# Altium project photodiodeAmplifier.PrjPcb
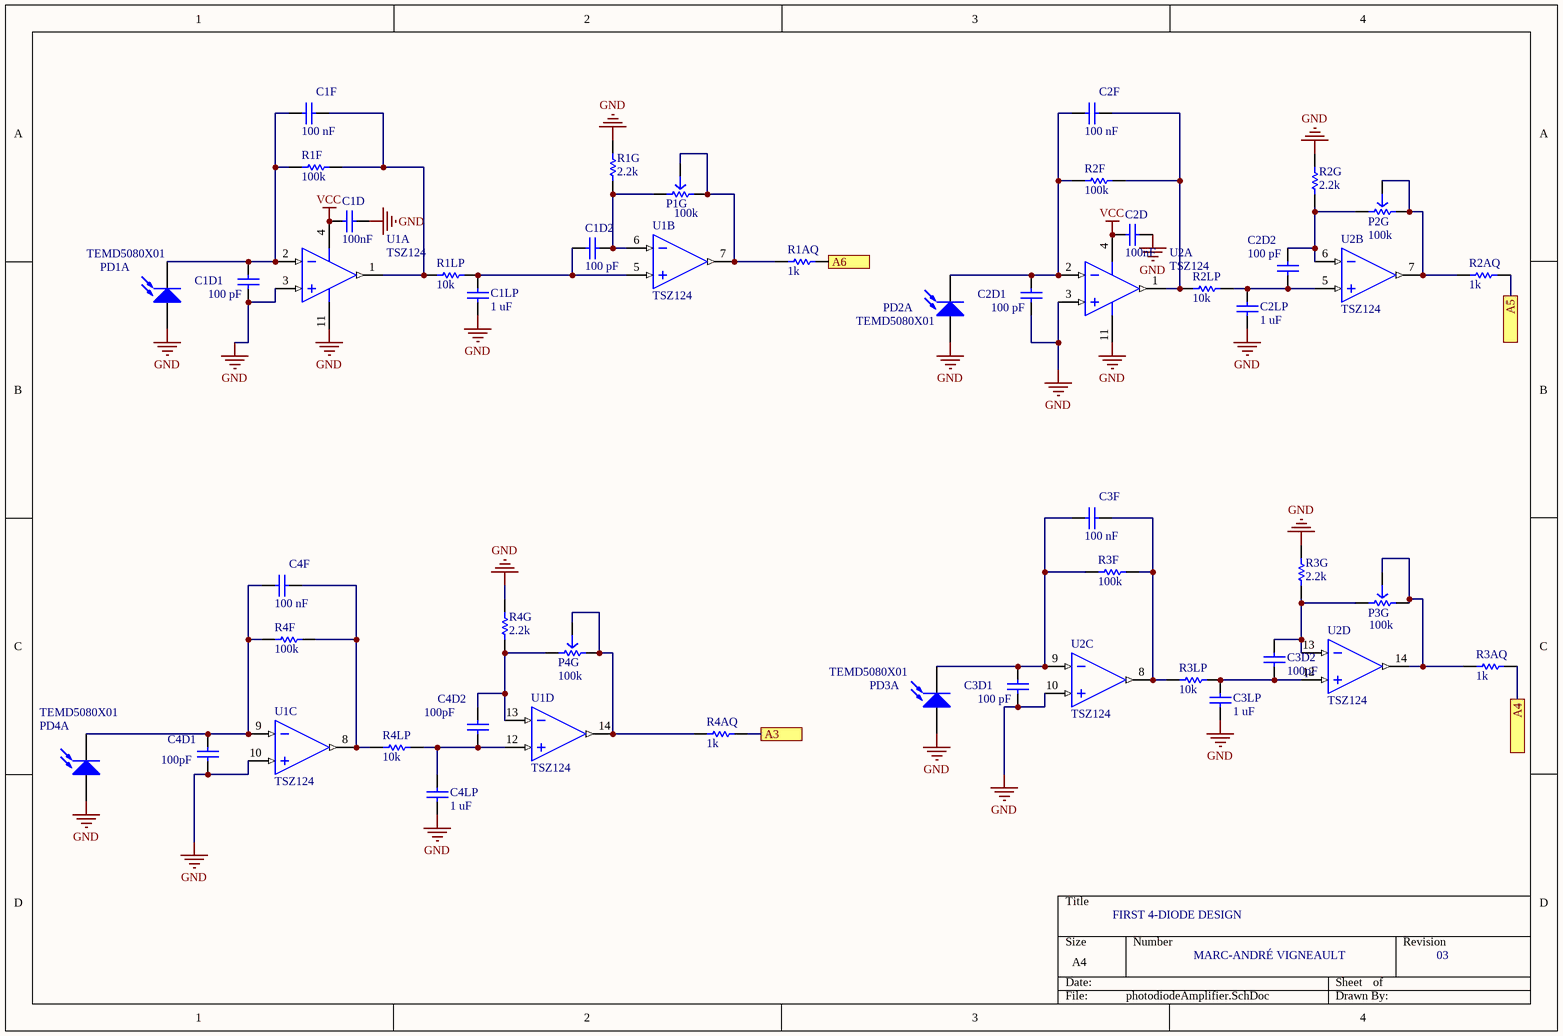
[diagram p0: photodiodeAmplifier.SchDoc]
2 sheets, 49 parts. Net scope: flat (ports and power ports of the same name join across sheets).
Board file: PD_PCB_with_routing.PcbDoc
Sheets:
  photodiodeAmplifier.SchDoc
  Sheet1.SchDoc

## Sheet photodiodeAmplifier.SchDoc
size A4

### Parts
C1D  100nF  [CAP 0805]
C1D1  100 pF  [CAP 0805]
C1D2  100 pF  [CAP 0805]
C1F  100 nF  [CAP 0805]
C1LP  1 uF  [CAP 0805]
C2D  100nF  [CAP 0805]
C2D1  100 pF  [CAP 0805]
C2D2  100 pF  [CAP 0805]
C2F  100 nF  [CAP 0805]
C2LP  1 uF  [CAP 0805]
C3D1  100 pF  [CAP 0805]
C3D2  100pF  [CAP 0805]
C3F  100 nF  [CAP 0805]
C3LP  1 uF  [CAP 0805]
C4D1  100pF  [CAP 0805]
C4D2  100pF  [CAP 0805]
C4F  100 nF  [CAP 0805]
C4LP  1 uF  [CAP 0805]
P1G  value 100k  [potentiometer trimmer straight]  (hidden comment: *)
P2G  value 100k  [potentiometer trimmer straight]  (hidden comment: Potentiometer Trimmer 90deg)
P3G  value 100k  [potentiometer trimmer straight]  (hidden comment: Potentiometer Trimmer 90deg)
P4G  value 100k  [potentiometer trimmer straight]
PD1  TEMD5080X01  [Photodiode SMD PKG-1]  (part A of 2)
PD2  TEMD5080X01  [Photodiode SMD PKG-1]  (part A of 2)
PD3  TEMD5080X01  [Photodiode SMD PKG-1]  (part A of 2)
PD4  TEMD5080X01  [Photodiode SMD PKG-1]  (part A of 2)
R1AQ  value 1k  [RES 0805]  (hidden comment: RES 0805)
R1F  value 100k  [RES 0805]  (hidden comment: RES 0805)
R1G  value 2.2k  [RES 0805]  (hidden comment: RES 0805)
R1LP  value 10k  [RES 0805]  (hidden comment: RES 0805)
R2AQ  value 1k  [RES 0805]  (hidden comment: RES 0805)
R2F  value 100k  [RES 0805]  (hidden comment: RES 0805)
R2G  value 2.2k  [RES 0805]  (hidden comment: RES 0805)
R2LP  value 10k  [RES 0805]  (hidden comment: RES 0805)
R3AQ  value 1k  [RES 0805]  (hidden comment: RES 0805)
R3F  value 100k  [RES 0805]  (hidden comment: RES 0805)
R3G  value 2.2k  [RES 0805]  (hidden comment: RES 0805)
R3LP  value 10k  [RES 0805]  (hidden comment: RES 0805)
R4AQ  value 1k  [RES 0805]  (hidden comment: RES 0805)
R4F  value 100k  [RES 0805]  (hidden comment: RES 0805)
R4G  value 2.2k  [RES 0805]  (hidden comment: RES 0805)
R4LP  value 10k  [RES 0805]  (hidden comment: RES 0805)
U1  TSZ124  [TSSOP14]  (parts A,B,C,D of 4)
U2  TSZ124  [TSSOP14]  (parts A,B,C,D of 4)

### Ports
A3, A4, A5, A6

### Nets
GND: C1D.1 C1D1.1 C1LP.1 C2D.1 C2D1.1 C2LP.1 C3D1.1 C3LP.1 C4D1.1 C4LP.1 PD1.1 PD2.1 PD3.1 PD4.1 R1G.2 R2G.2 R3G.2 R4G.2 U1.3(INA+) U1.10(INA+) U1.11(V-) U2.3(INA+) U2.10(INA+) U2.11(V-)
VCC: C1D.2 C2D.2 U1.4(V+) U2.4(V+)
Net*_21: R4AQ.2 ; port A3
Net*_22: R3AQ.2 ; port A4
Net*_23: R2AQ.2 ; port A5
Net*_24: R1AQ.2 ; port A6
NetC1D1_2: C1D1.2 C1F.1 PD1.2 R1F.1 U1.2(INA-)
NetC1D2_1: C1D2.1 C1LP.2 R1LP.2 U1.5(INA+)
NetC1D2_2: C1D2.2 P1G.3 R1G.1 U1.6(INA-)
NetC1F_2: C1F.2 R1F.2 R1LP.1 U1.1(OUTA)
NetC2D1_2: C2D1.2 C2F.1 PD2.2 R2F.1 U2.2(INA-)
NetC2D2_1: C2D2.1 C2LP.2 R2LP.2 U2.5(INA+)
NetC2D2_2: C2D2.2 P2G.3 R2G.1 U2.6(INA-)
NetC2F_2: C2F.2 R2F.2 R2LP.1 U2.1(OUTA)
NetC3D1_2: C3D1.2 C3F.1 PD3.2 R3F.1 U2.9(INA-)
NetC3D2_1: C3D2.1 C3LP.2 R3LP.2 U2.12(INA+)
NetC3D2_2: C3D2.2 P3G.3 R3G.1 U2.13
NetC3F_2: C3F.2 R3F.2 R3LP.1 U2.8(OUTA)
NetC4D1_2: C4D1.2 C4F.1 PD4.2 R4F.1 U1.9(INA-)
NetC4D2_1: C4D2.1 C4LP.2 R4LP.2 U1.12(INA+)
NetC4D2_2: C4D2.2 P4G.3 R4G.1 U1.13
NetC4F_2: C4F.2 R4F.2 R4LP.1 U1.8(OUTA)
NetP1G_1: P1G.1 P1G.2 R1AQ.1 U1.7(OUTA)
NetP2G_1: P2G.1 P2G.2 R2AQ.1 U2.7(OUTA)
NetP3G_1: P3G.1 P3G.2 R3AQ.1 U2.14(OUTA)
NetP4G_1: P4G.1 P4G.2 R4AQ.1 U1.14(OUTA)

### Notes on the sheet
- FIRST 4-DIODE DESIGN
- MARC-ANDRÉ VIGNEAULT
- 03

### Library data of the parts
C1D C1D1 C1D2 C1F C1LP C2D C2D1 C2D2 C2F C2LP C3D1 C3D2 C3F C3LP C4D1 C4D2 C4F C4LP = CAP 0805: Value: 5 pF
P1G P4G = Potentiometer Trimmer 90deg
PD1-PD4 = TEMD5080X01: PIN Sillicium photodiode.
R1AQ R1F R1G R1LP R2AQ R2F R2G R2LP R3AQ R3F R3G R3LP R4AQ R4F R4G R4LP = RES 0805: SMD Resistor 0805

## Sheet Sheet1.SchDoc
size B
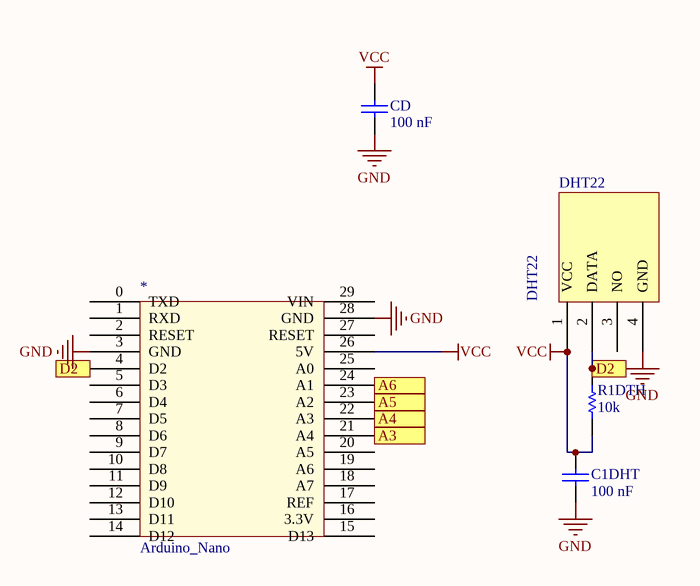
[diagram p1: Sheet1.SchDoc]

### Parts
*  Arduino_Nano  [Arduino Nano SMD]
C1DHT  100 nF  [CAP 0805]
CD  100 nF  [CAP 0805]
DHT22  DHT22  [DHT22 - 90deg SMD]
R1DTH  value 10k  [RES 0805]  (hidden comment: RES 0805)

### Ports
A3, A4, A5, A6, D2

### Nets
GND: *.3(GND) *.28(GND) C1DHT.1 CD.1 DHT22.4(GND)
VCC: *.26(5V) C1DHT.2 CD.2 DHT22.1(VCC) R1DTH.1
Net*_4: *.4(D2) DHT22.2(DATA) R1DTH.2 ; port D2
Net*_21: *.21(A4) ; port A3
Net*_22: *.22(A3) ; port A4
Net*_23: *.23(A2) ; port A5
Net*_24: *.24(A1) ; port A6

Not connected (* = marked no-connect by the designer): * 0(TXD) 1(RXD) 2(RESET) 5(D3) 6(D4) 7(D5) 8(D6) 9(D7) 10(D8) 11(D9) 12(D10) 13(D11) 14(D12) 15(D13) 16(3.3V) 17(REF) 18(A7) 19(A6) 20(A5) 25(A0) 27(RESET) 29(VIN); DHT22 3(NO)

### Library data of the parts
C1DHT CD = CAP 0805: Value: 5 pF
R1DTH = RES 0805: SMD Resistor 0805

## Nets that join several sheets
GND: photodiodeAmplifier (24 pins), Sheet1 (5 pins)
VCC: photodiodeAmplifier (C1D.2 C2D.2 U1.4 U2.4), Sheet1 (5 pins)
Net*_21: photodiodeAmplifier (R4AQ.2), Sheet1 (*.21)
Net*_22: photodiodeAmplifier (R3AQ.2), Sheet1 (*.22)
Net*_23: photodiodeAmplifier (R2AQ.2), Sheet1 (*.23)
Net*_24: photodiodeAmplifier (R1AQ.2), Sheet1 (*.24)